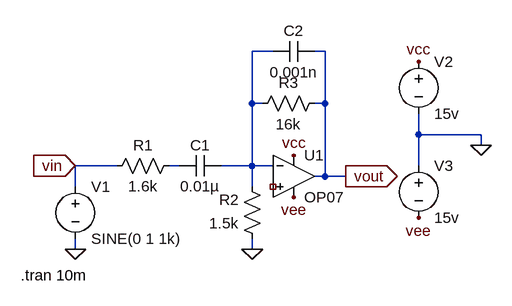
[diagram p0: schematic exp4_diff_electro.asc]
exp4_diff_electro.asc, the LTspice schematic file:
Version 4
SHEET 1 948 680
WIRE 464 -64 432 -64
WIRE 544 -64 528 -64
WIRE 432 16 432 -64
WIRE 448 16 432 16
WIRE 544 16 544 -64
WIRE 544 16 528 16
WIRE 688 64 688 32
WIRE 784 64 688 64
WIRE 784 80 784 64
WIRE 224 112 160 112
WIRE 320 112 304 112
WIRE 432 112 432 16
WIRE 432 112 384 112
WIRE 464 112 432 112
WIRE 688 112 688 64
WIRE 544 128 544 16
WIRE 544 128 528 128
WIRE 576 128 544 128
WIRE 160 144 160 112
WIRE 432 144 432 112
WIRE 160 240 160 224
WIRE 432 240 432 224
FLAG 784 80 0
FLAG 160 240 0
FLAG 432 240 0
FLAG 160 112 vin
IOPIN 160 112 In
FLAG 576 128 vout
IOPIN 576 128 Out
FLAG 688 -48 vcc
FLAG 496 96 vcc
FLAG 688 192 vee
FLAG 496 160 vee
SYMBOL voltage 160 128 R0
WINDOW 123 0 0 Left 0
WINDOW 39 0 0 Left 0
SYMATTR InstName V1
SYMATTR Value SINE(0 1 1k)
SYMBOL res 320 96 R90
WINDOW 0 0 56 VBottom 2
WINDOW 3 32 56 VTop 2
SYMATTR InstName R1
SYMATTR Value 1.6k
SYMBOL res 448 240 R180
WINDOW 0 36 76 Left 2
WINDOW 3 36 40 Left 2
SYMATTR InstName R2
SYMATTR Value 1.5k
SYMBOL res 544 0 R90
WINDOW 0 0 56 VBottom 2
WINDOW 3 32 56 VTop 2
SYMATTR InstName R3
SYMATTR Value 16k
SYMBOL cap 528 -80 R90
WINDOW 0 0 32 VBottom 2
WINDOW 3 32 32 VTop 2
SYMATTR InstName C2
SYMATTR Value 0.001n
SYMBOL voltage 688 -64 R0
WINDOW 123 0 0 Left 0
WINDOW 39 0 0 Left 0
SYMATTR InstName V2
SYMATTR Value 15v
SYMBOL voltage 688 96 R0
WINDOW 123 0 0 Left 0
WINDOW 39 0 0 Left 0
SYMATTR InstName V3
SYMATTR Value 15v
SYMBOL Opamps\\OP07 496 64 R0
SYMATTR InstName U1
SYMBOL cap 384 96 R90
WINDOW 0 0 32 VBottom 2
WINDOW 3 32 32 VTop 2
SYMATTR InstName C1
SYMATTR Value 0.01µ
TEXT 76 280 Left 2 !.tran 10m

The netlist it stands for:
* exp4_diff_electro.asc
V1 vin 0 SINE(0 1 1k)
R1 N002 vin 1.6k
R2 0 N001 1.5k
R3 vout N001 16k
C2 vout N001 0.001n
V2 vcc 0 15v
V3 0 vee 15v
XU1 NC_01 N001 vcc vee vout LT1001  ; OP07, pins In+ In- V+ V- OUT
C1 N001 N002 0.01µ
.tran 10m
.lib LTC.lib
.backanno
.end